# Altium schematic sheet 8_oledDisplay.SchDoc
size A4
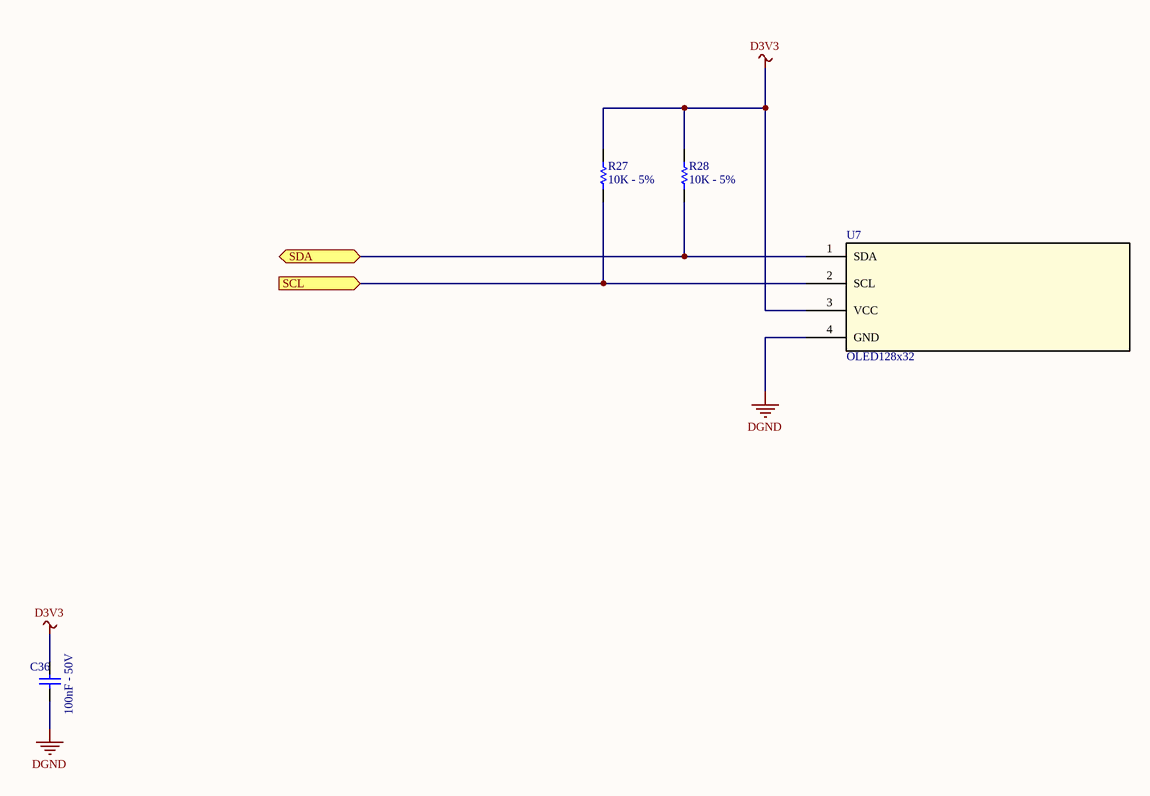
[diagram p0: 8_oledDisplay.SchDoc]

## Parts
C36  VALOR: 100nF - 50V  [SMD0805-CAP]  (hidden comment: Capacitor 100 nF - 10%)
R27  VALOR: 10K - 5%  [SMD0805]  (hidden comment: 10K - 5% - 0805 - 328)
R28  VALOR: 10K - 5%  [SMD0805]  (hidden comment: 10K - 5% - 0805 - 328)
U7  OLED128x32  [OLEDGREATZT128x32]

## Ports
SCL (in), SDA (bidir)

## Nets
D3V3: C36.1 R27.2 R28.2 U7.3(VCC)
DGND: C36.2 U7.4(GND)
SCL: R27.1 U7.2(SCL) ; port SCL
SDA: R28.1 U7.1(SDA) ; port SDA

## Library data of the parts
C36 = 100nF - 50V - 10% - 0805 - 580: Capacitor 100nF, 10%, SMD 0805; MANUFACTURER: AVX; PARTNUMBER: 08055C104KAT2A; CODIGO: 580; EMBALAGEM: REEL; FORNECEDOR: VARIOS; DESC: CAP 100nF, 50V, SMD0805, 10%, X7R, CERAMICO MULTICAMADA; TARGET MÁX U$: $0,0041; ComponentLink1Description: Datasheet; ComponentLink1URL: http://www.avx.com/docs/catalogs/cx7r.pdf; ComponentLink2Description: HOME AVX; ComponentLink2URL: http://www.avx.com/; ENCAPSULAMENTO: SMD0805; FACTORY PACK: 4000; LOCALIZAÇÃO: *; Supplier 1: Mouser; Supplier Part Number 1: 08055C104KAT2A; NCM: 8532.21.11
R27 R28 = 10K - 5% - 0805 - 328: Resistor 10K, 5%, SMD 0805; PARTNUMBER: RC2012J103CS; MANUFACTURER: SAMSUNG; CODIGO: 328; EMBALAGEM: REEL; FORNECEDOR: VARIOS; DESC: RES 10K, 5%, SMD 0805, MF; TARGET MÁX U$: $0.0012; ENCAPSULAMENTO: SMD0805; FACTORY PACK: 5000; ComponentLink1URL: http://media.digikey.com/pdf/Data%20Sheets/Samsung%20PDFs/CHIP_RESISTOR_Catalog.pdf; ComponentLink1Description: Datasheet; ComponentLink2Description: HOME SANSUNG; ComponentLink2URL: http://www.samsung.com/global/business/semiconductor/; Supplier 1: Digi-Key; Supplier Part Number 1: 1276-5552-1-ND; NCM: 8533.21.20